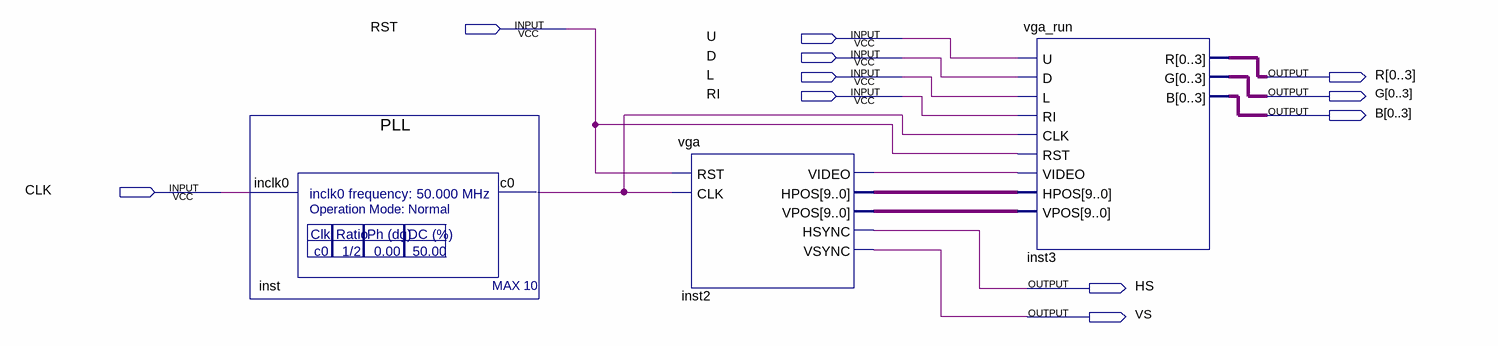
[diagram p0: schematic sheet]
// Quartus schematic vga_final.bdf as structural Verilog: 3 symbols, 11 pins
module vga_final (
  input  RST,
  input  U,
  input  D,
  input  L,
  input  RI,
  input  CLK,
  output [0:3] R,
  output [0:3] G,
  output [0:3] B,
  output HS,
  output VS
);

  wire inst2_video, inst_c0;
  wire [9:0] inst2_hpos, inst2_vpos;

  PLL inst (.inclk0(CLK), .c0(inst_c0));
  vga inst2 (
    .RST(RST), .CLK(inst_c0), .VIDEO(inst2_video), .HPOS(inst2_hpos), .VPOS(inst2_vpos), .HSYNC(HS),
    .VSYNC(VS));
  vga_run inst3 (
    .U(U), .D(D), .L(L), .RI(RI), .CLK(inst_c0), .RST(RST), .VIDEO(inst2_video), .HPOS(inst2_hpos),
    .VPOS(inst2_vpos), .R(R), .G(G), .B(B));
endmodule
